# EAGLE design lipo_fuel_gauge-v11 (EAGLE 5.06)
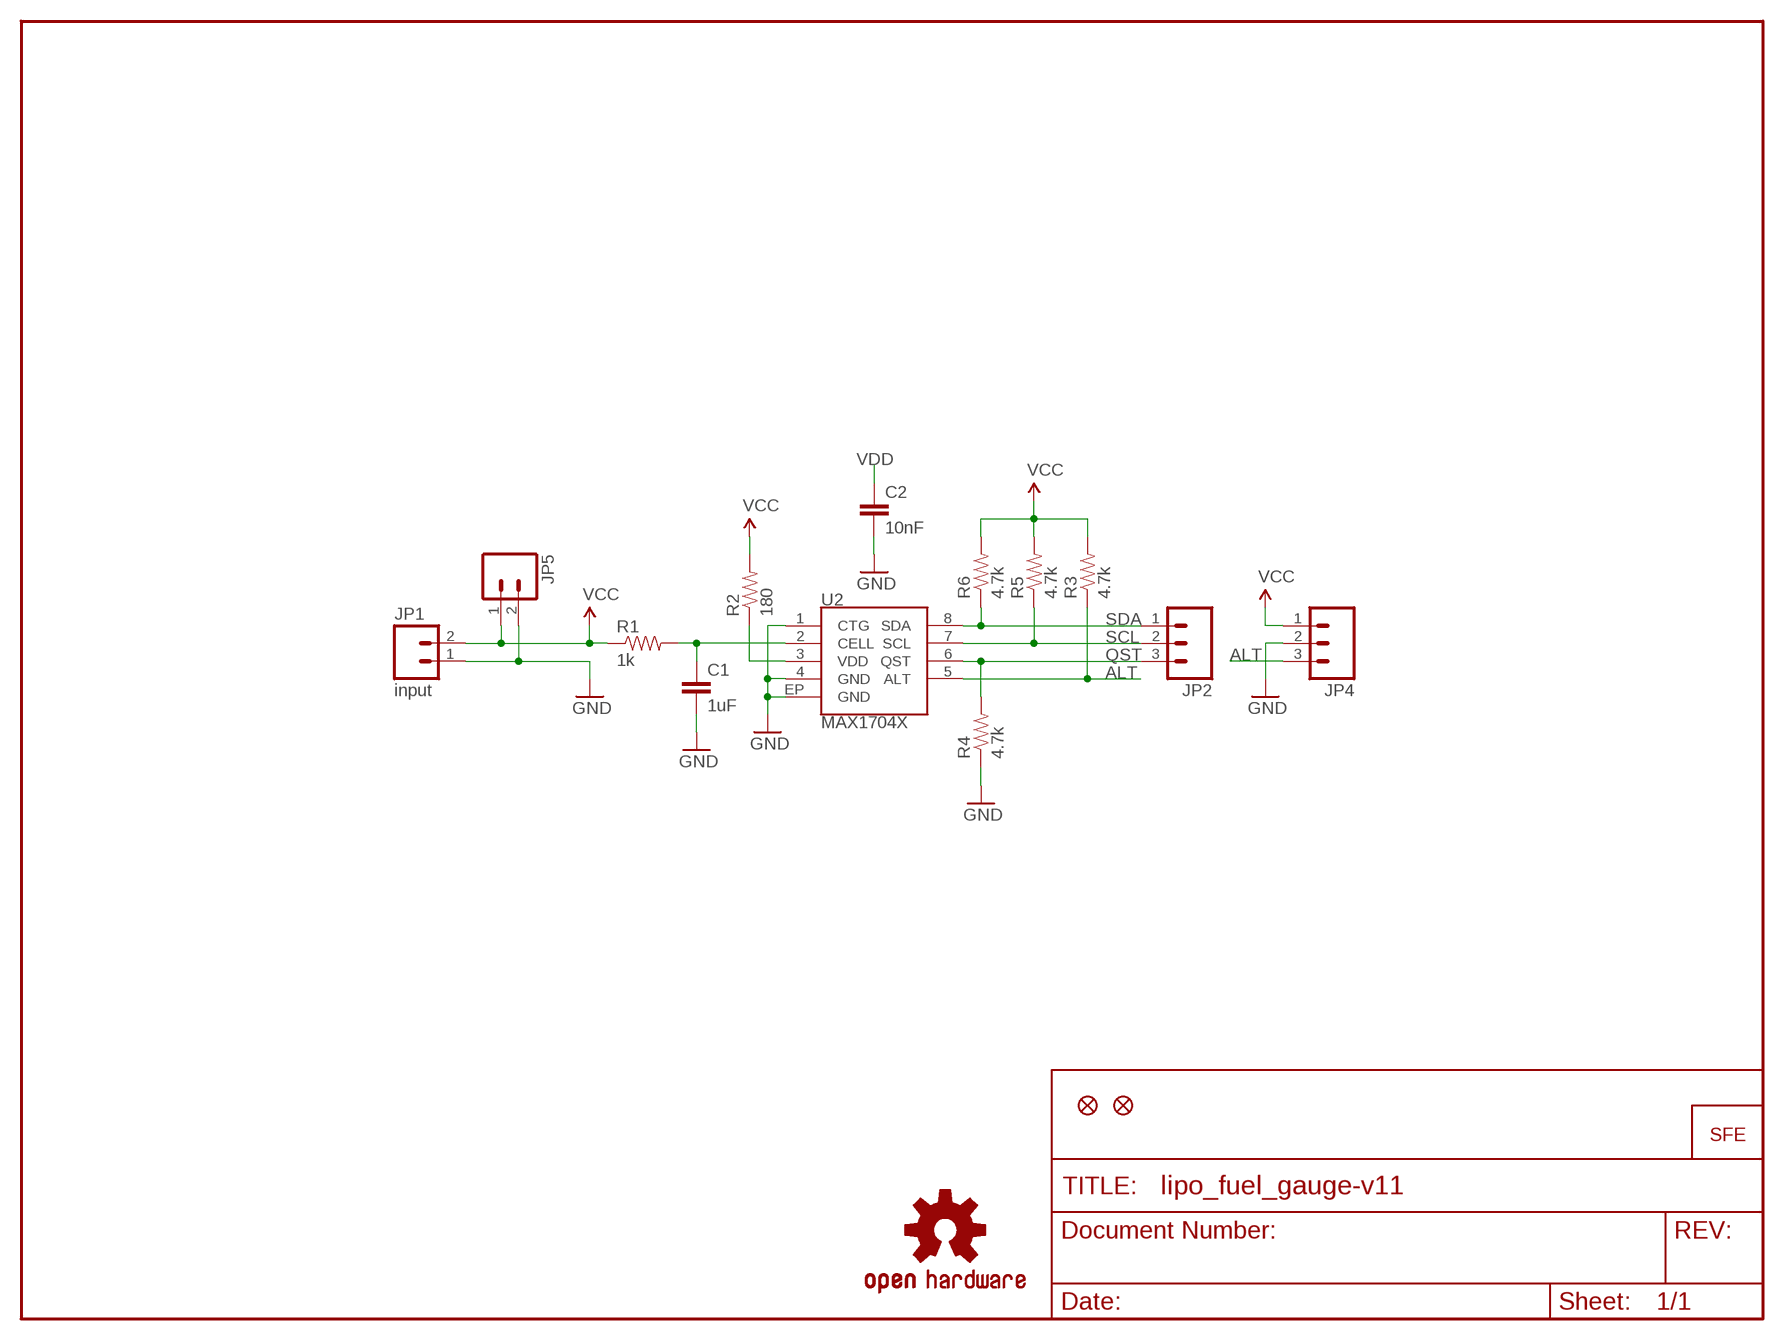
[diagram p0: schematic, sheet 1]

## Parts
C1  1uF  CAP0402-CAP  [0402-CAP]
C2  10nF  CAP0402-CAP  [0402-CAP]
JP1  input  M02-JST-2MM-SMT  [JST-2-SMD]
JP2  M03PTH  [1X03]
JP3  LOGO-SFESK  [SFE-LOGO-FLAME]
JP4  M03PTH  [1X03]
JP5  M02PTH  [1X02]
JP6  FIDUCIAL1X2.5  [FIDUCIAL-1X2.5]
JP7  FIDUCIAL1X2.5  [FIDUCIAL-1X2.5]
R1  1k  RESISTOR0402-RES  [0402-RES]
R2  180  RESISTOR0402-RES  [0402-RES]
R3  4.7k  RESISTOR0402-RES  [0402-RES]
R4  4.7k  RESISTOR0402-RES  [0402-RES]
R5  4.7k  RESISTOR0402-RES  [0402-RES]
R6  4.7k  RESISTOR0402-RES  [0402-RES]
U2  MAX1704X  [TDFN-8]
U$1  OSHW-LOGOS  [OSHW-LOGO-S]

## Nets
ALT: JP4.3 R3.1 U2.5(ALT)
GND: C1.2 C2.2 JP1.1 JP4.2 JP5.2 R4.1 U2.1(CTG) U2.4(GND) U2.EP(GND)
N$2: C1.1 R1.2 U2.2(CELL)
QST: JP2.3 R4.2 U2.6(QST)
SCL: JP2.2 R5.1 U2.7(SCL)
SDA: JP2.1 R6.1 U2.8(SDA)
VCC: JP1.2 JP4.1 JP5.1 R1.1 R2.2 R3.2 R5.2 R6.2
VDD: C2.1 R2.1 U2.3(VDD)

## Library data of the parts
C1 C2 = SparkFun:CAP: Capacitor Standard 0603 ceramic capacitor, and 0.1" leaded capacitor.
JP1 JP5 = SparkFun:M02: Header 2 Standard 2-pin 0.1" header. Use with straight break away headers (SKU : PRT-00116), right angle break away headers (PRT-00553), swiss pins (PRT-00743), machine pins (PRT-00117), and female headers (PRT-00115). Molex polarized connector foot print use with SKU : PRT-08233 with associated crimp pins and housings.
JP2 JP4 = SparkFun:M03: Header 3 Standard 3-pin 0.1" header. Use with straight break away headers (SKU : PRT-00116), right angle break away headers (PRT-00553), swiss pins (PRT-00743), machine pins (PRT-00117), and female headers (PRT-00115). Molex polarized connector foot print use with SKU : PRT-08232 with associated crimp pins and housings.
JP3 = SparkFun:LOGO-SFE: Spark Fun Electronics PCB Logo This is the standard Spark Fun Electronics PCB logo.
JP6 JP7 = abes:FIDUCIAL: Fiducial Alignment Points Various fiducial points for machine vision alignment.
R1-R6 = SparkFun:RESISTOR: Resistor Basic schematic elements and footprints for 0603, 1206, and PTH resistors.
U2 = SparkFun:MAX1704X: MAX17043/MAX17044: Battery Fuel Guage (43 is 1cell, 44 is 2cell)
U$1 = SparkFun:OSHW-LOGO: Open Source Hardware Logo This logo indicates the piece of hardware it is found on incorporates a OSHW license and/or adheres to the definition of open source hardware found here: http://freedomdefined.org/OSHW

## Board
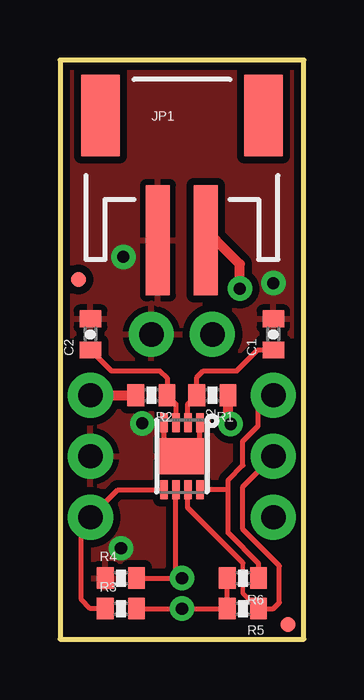
[diagram p1: board, top side]
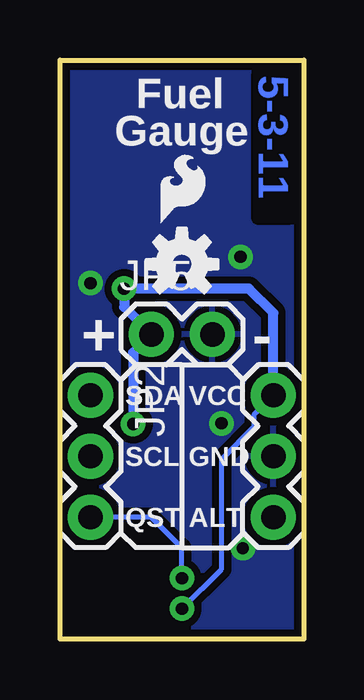
[diagram p2: board, bottom side, seen from below]

Size 10.16 x 24.13 mm. Coordinates in mm from the lower left corner, seen from the top.
Outline: 0,24.13 0,0 10.16,0 10.16,24.13 0,24.13
Copper layers (1*16): Top 0.035mm / dielectric 1.5mm / Bottom 0.035mm
Design rules "SparkFun": minimum track width 8mil, minimum drill 20mil, track to track 8mil, track to pad 8mil, pad to pad 8mil, via to via 8mil, smd to smd 8mil, copper to edge 8mil, drill to drill 8mil, minimum pad ring 12mil, minimum via ring 10mil, stop-mask expansion 4mil, vias tented up to drill 20mil, thermal gap 10mil

### Footprints (pad centres in the part's own frame; a part is rotated, then mirrored left to right if it is on the bottom)
0402-CAP = smd 0.7 x 0.9: 1 -0.65,0; 2 0.65,0
JST-2-SMD = smd 1 x 4.6: 1 -1,-3.7; 2 1,-3.7 | smd 1.6 x 3.4: NC1 -3.4,1.5; NC2 3.4,1.5
1X03 = drill 1.016 pad 1.88 round: 1 0,0; 2 2.54,0; 3 5.08,0
1X02 = drill 1.016 pad 1.88 round: 1 0,0; 2 2.54,0
FIDUCIAL-1X2.5 = smd 0.635 x 0.635: 1 0,0
0402-RES = smd 0.7 x 0.9: 1 -0.65,0; 2 0.65,0
TDFN-8 = smd 0.8 x 0.3: 1 -1.4,0.75; 2 -1.4,0.25; 3 -1.4,-0.25; 4 -1.4,-0.75; 5 1.4,-0.75; 6 1.4,-0.25; 7 1.4,0.25; 8 1.4,0.75 | smd 1.5 x 1.88: EP 0,0

### Placement (x,y rotation side)
C1  8.89,12.7 90 top
C2  1.27,12.7 90 top
JP1  5.08,20.32 0 top
JP2  8.89,10.16 270 bottom
JP3  5.97,17.35 0 bottom
JP4  1.27,10.16 270 bottom
JP5  6.35,12.7 0 bottom
JP6  9.5,0.61 0 top
JP7  0.76,14.99 0 top
R1  6.35,10.16 180 top
R2  3.81,10.16 180 top
R3  2.54,1.27 0 top
R4  2.54,2.54 0 top
R5  7.62,1.27 180 top
R6  7.62,2.54 180 top
U2  5.08,7.62 270 top
U$1  5.08,15.62 0 bottom

### Tracks (layer width: path | path; a pad name or v marks a point on that pad's centre or on a via)
ALT
  Top 0.203: U2.5 2.41,6.22 JP4.3 0.89,4.7 0.89,1.65 1.27,1.27 R3.1
GND  (via drill 0.51)
  Top 0.203: U2.4 4.33,8.37 U2.EP 5.21,7.62 5.84,8.26 5.83,8.27 U2.1
  other vias: 2.64,15.93 3.43,8.99 8.89,14.83 2.54,3.78
  pour Bottom (isolate 0.305): 10.16,24.13 0,24.13 0,0 10.16,0
  pour Top (isolate 0.305): 10.16,24.13 0,24.13 0,0 10.16,0
N$2
  Top 0.203: U2.2 5.33,9.79 R1.2 5.7,10.91 5.97,11.18 7.37,11.18 8.24,12.05 C1.1
QST  (via drill 0.51)
  Top 0.203: R4.2 v5.08,2.54 4.83,2.79 U2.6
  Bottom 0.203: JP2.3 6.35,5.08 5.08,3.81 v5.08,2.54
SCL
  Top 0.178: 7.62,3.17 7.62,1.92 R5.1
  Top 0.203: JP2.2 7.62,6.35 7.62,4.57 9.14,3.05 9.14,1.52 8.89,1.27 R5.1 | U2.7 5.33,5.46 7.62,3.17
SDA
  Top 0.203: JP2.1 8.26,9.53 8.26,8.89 7.62,8.26 7.62,7.24 7,6.62 7,6.2 | U2.8 6.98,6.22 7,6.2 | 7,6.2 7,4.43 8.27,3.16 R6.1
VCC  (via drill 0.51)
  Top 0.203: R6.2 R5.2 v5.08,1.27 R3.2
  Top 0.406: JP4.1 R2.2 | R1.1 7,9.13 v7.11,8.97 | JP1.2 6.49,16.62 7.49,15.62 v7.49,14.61
  Bottom 0.203: 1.27,10.03 JP4.1 2.06,9.37 2.06,8.87 3.43,7.49 3.43,2.92 v5.08,1.27
  Bottom 0.406: v7.11,8.97 7.11,11.94 JP5.1 7.49,13.84 v7.49,14.61 2.29,14.61 1.27,13.59 JP4.1
VDD
  Top 0.203: U2.3 4.83,9.79 R2.1 4.46,10.88 4.17,11.18 2.14,11.18 C2.1 1.54,12.05

### Text on the board
Bottom: 5-3-11
bPlace: Fuel | Gauge | - | + | VCC | SDA | GND | SCL | ALT | QST